# EAGLE board AllOfTheAbove7x14nov_stijnrouting (EAGLE 7.7.0)
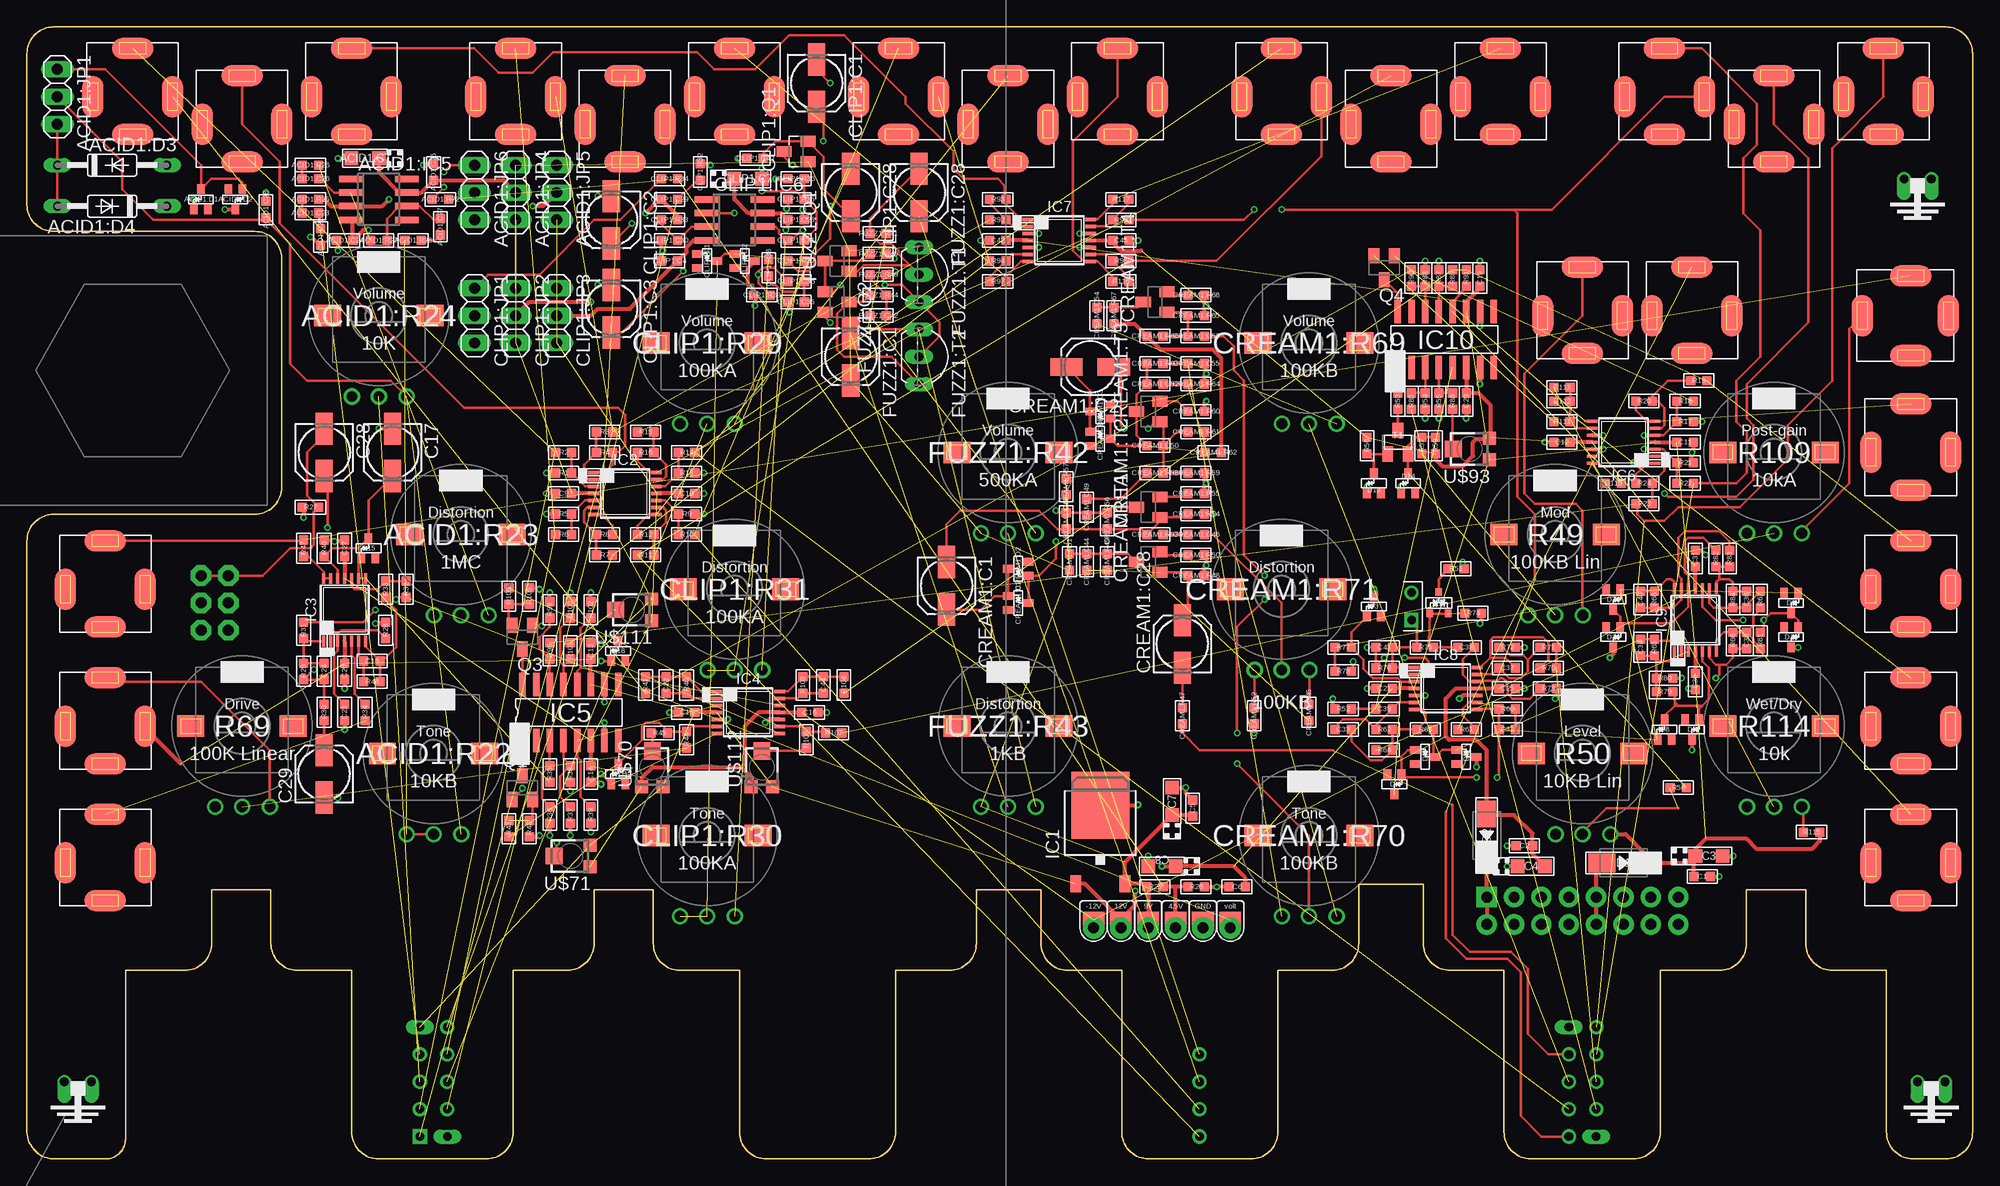
[diagram p10: board, top side]
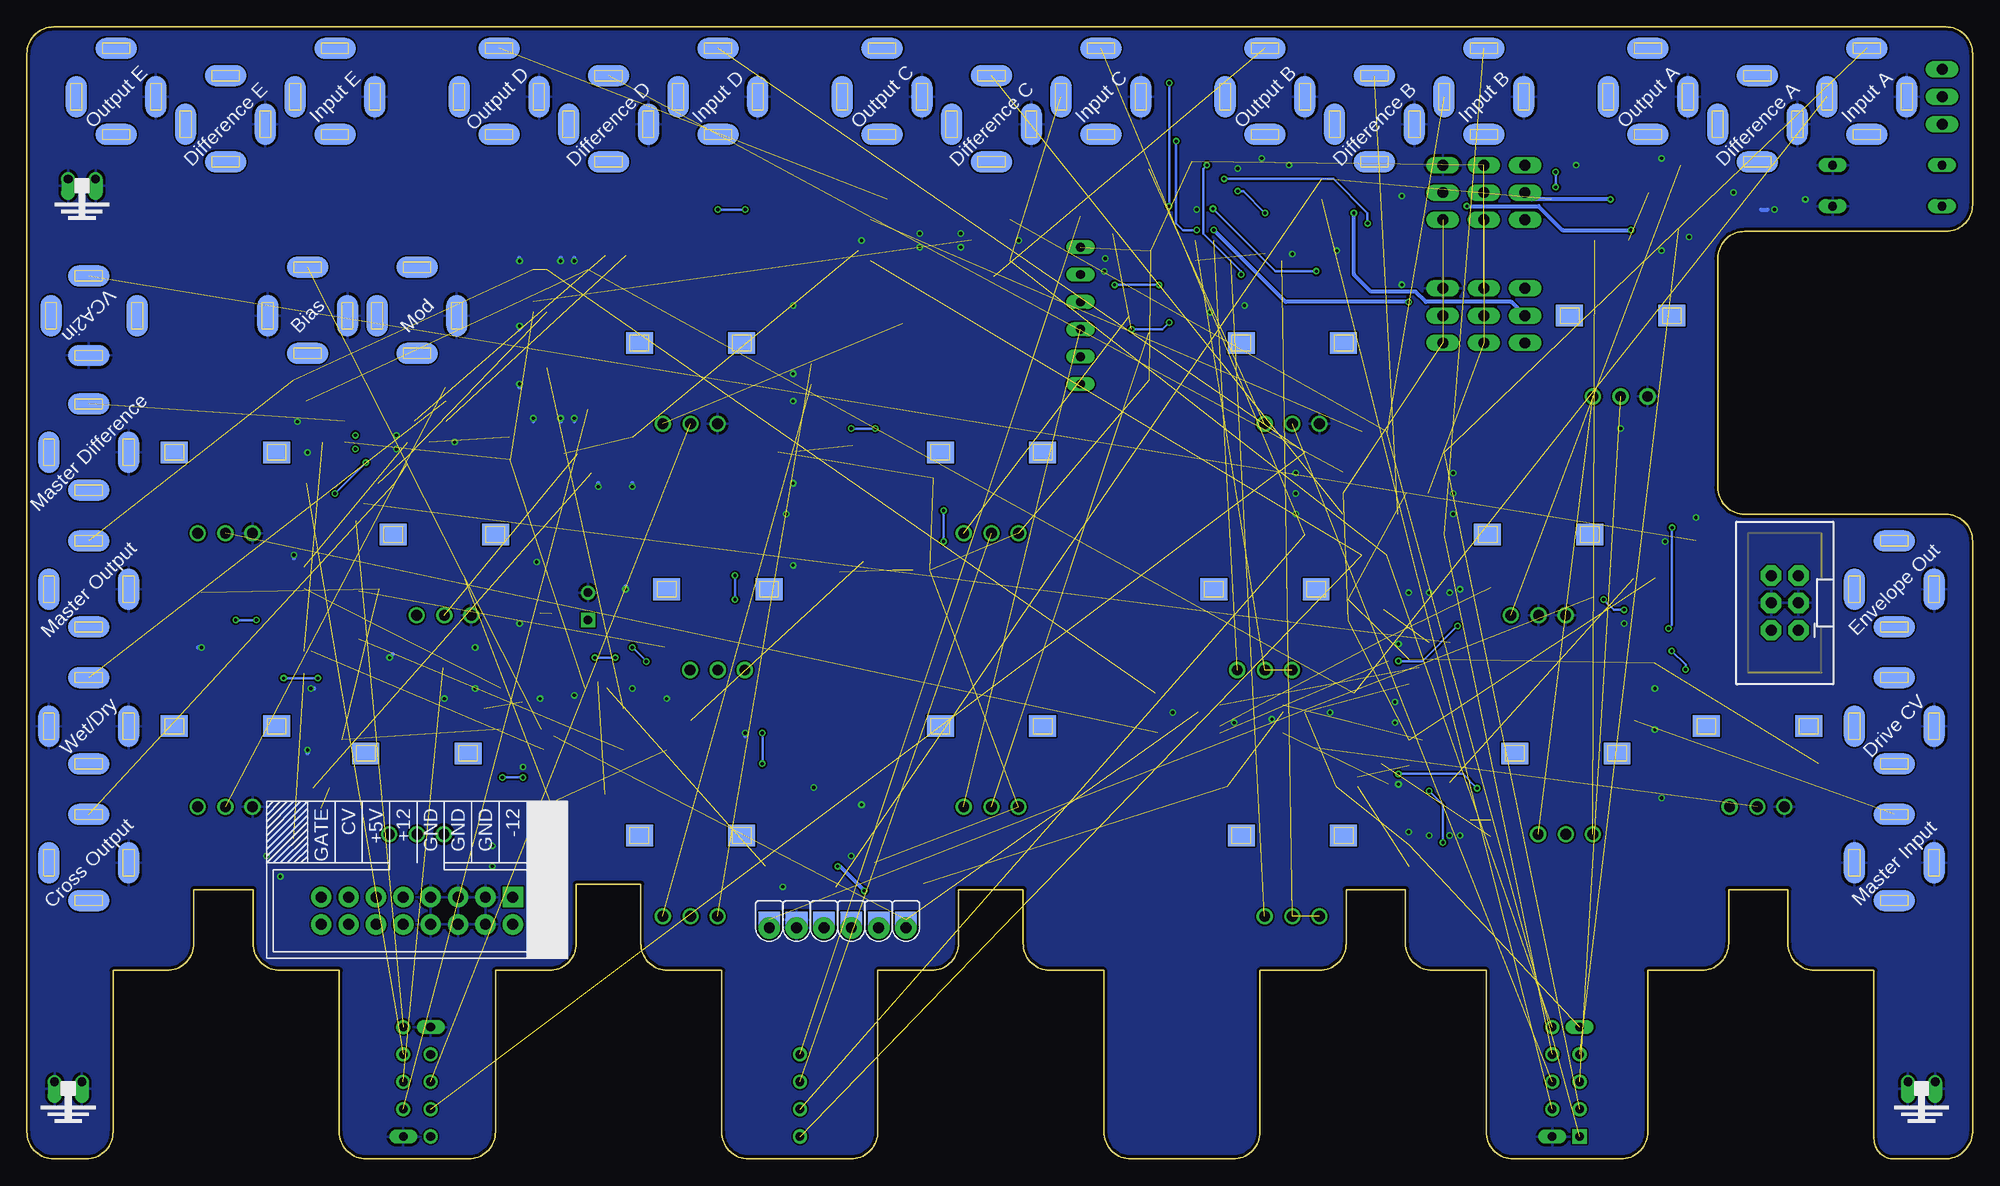
[diagram p11: board, bottom side, seen from below]

Size 180.66 x 105.08 mm. Coordinates in mm from the lower left corner, seen from the top.
Copper layers (1*16): Top 0.035mm / dielectric 1.5mm / Bottom 0.035mm
Design rules "ITeadstudio": minimum track width 6mil, minimum drill 12mil, track to track 6mil, track to pad 6mil, pad to pad 6mil, via to via 6mil, smd to smd 0mil, copper to edge 10mil, drill to drill 10mil, minimum pad ring 10mil, minimum via ring 6mil, stop-mask expansion 2mil, vias tented up to drill 100mil, thermal gap 10mil
Net classes: 0 default: width 0.254 mm; 1 power: width 0.381 mm

## Footprints (pad centres in the part's own frame; a part is rotated, then mirrored left to right if it is on the bottom)
CASE-A_3216 = smd 1.27 x 1.27: + -1.27,0; - 1.27,0
C0603 = smd 0.889 x 0.889: 1 -0.762,0; 2 0.762,0
SOT-323 = smd 0.7 x 0.9: ANODE -0.65,-0.95; CATHODE 0,0.95; NC 0.65,-0.95
DO35-10 = drill 0.813 long: A 5.08,0; C -5.08,0
SO08 = smd 0.6 x 2.2: 1 -1.905,-2.6; 2 -0.635,-2.6; 3 0.635,-2.6; 4 1.905,-2.6; 5 1.905,2.6; 6 0.635,2.6; 7 -0.635,2.6; 8 -1.905,2.6
1X03 = drill 1.016 long: 1 -2.54,0; 2 0,0; 3 2.54,0
ALPS_POT_SQUAREHOLES = drill 1: P$1 -2.5,-7.5; P$2 0,-7.5; P$3 2.58,-7.5 | smd 2.5 x 2: P$4 -4.75,0; P$5 4.75,0 | smd 2.5 x 2 bottom: P$6 -4.75,0; P$7 4.75,0
R0603 = smd 0.889 x 0.889: 1 -0.762,0; 2 0.762,0
153CLV-0505 = smd 3 x 1.6: + 2.2,0; - -2.2,0
SOT23 = smd 1 x 1.4: 1 -0.95,-1.1; 2 0.95,-1.1; 3 0,1.1
SOT23-BEC = smd 1 x 1.4: B -0.95,-1.1; C 0,1.1; E 0.95,-1.1
DO-214AC = smd 2.5 x 1.7: 1 -2,0; 2 2,0
TO92-EBC = drill 0.813 long: B 0,-1.27; C 2.54,-1.27; E -2.54,-1.27
TO252 = smd 1 x 1.6: 1 -2.28,-4.8; 2 2.28,-4.8 | smd 5.4 x 6.2: 3 0,2.5
TSSOP14 = smd 0.305 x 0.991: 1 -1.95,-2.918; 2 -1.3,-2.918; 3 -0.65,-2.918; 4 0,-2.918; 5 0.65,-2.918; 6 1.3,-2.918; 7 1.95,-2.918; 8 1.95,2.918; 9 1.3,2.918; 10 0.65,2.918; 11 0,2.918; 12 -0.65,2.918; 13 -1.3,2.918; 14 -1.95,2.918
SO16 = smd 0.6 x 2.2: 1 -4.445,-2.6; 2 -3.175,-2.6; 3 -1.905,-2.6; 4 -0.635,-2.6; 5 0.635,-2.6; 6 1.905,-2.6; 7 3.175,-2.6; 8 4.445,-2.6; 9 4.445,2.6; 10 3.175,2.6; 11 1.905,2.6; 12 0.635,2.6; 13 -0.635,2.6; 14 -1.905,2.6; 15 -3.175,2.6; 16 -4.445,2.6
3.5MM-JACK-SWITCH-13MM-NOHOLES = smd 1.95 x 3.85 bottom: RING_B@1 -3.7,0; SWITCH_B@1 3.7,0 | smd 1.95 x 3.85: RING_T@3 -3.7,0; SWITCH_T@3 3.7,0 | smd 3.85 x 1.95 bottom: SECOND_B@1 0,-3.5; TIP_B@1 0,4.5 | smd 3.85 x 1.95: SECOND_T@3 0,-3.5; TIP_T@3 0,4.5
POWER_16_SHROUDED = drill 1.016 pad 1.88 square: 1 -8.89,-1.27 | drill 1.016 pad 1.88: 2 -8.89,1.27; 3 -6.35,-1.27; 4 -6.35,1.27; 5 -3.81,-1.27; 6 -3.81,1.27; 7 -1.27,-1.27; 8 -1.27,1.27; 9 1.27,-1.27; 10 1.27,1.27; 11 3.81,-1.27; 12 3.81,1.27; 13 6.35,-1.27; 14 6.35,1.27; 15 8.89,-1.27; 16 8.89,1.27
POWERTESTPAD = drill 1 pad 2: P$1 0,0 | smd 2 x 1.5: P$2 0,-0.75 | smd 2 x 1.5 bottom: P$3 0,-0.75
BYPASSBOARD = drill 0.8 long: 12V 31.75,15.24; GND 34.29,5.08; GND2 138.43,15.24; GND3 140.97,5.08 | drill 0.8 square: P$1 31.75,5.08 | drill 0.8: P$2 31.75,10.16; P$3 31.75,7.62; P$4 31.75,12.7; P$5 34.29,15.24; P$6 34.29,10.16; P$7 34.29,12.7; P$8 34.29,7.62; P$9 104.14,5.08; P$10 104.14,10.16; P$11 104.14,7.62; P$12 104.14,12.7; P$13 138.43,5.08; P$14 138.43,10.16; P$15 138.43,7.62; P$16 138.43,12.7; P$17 140.97,15.24; P$18 140.97,10.16; P$19 140.97,12.7; P$20 140.97,7.62
GROUNDLOOP = drill 0.8 offset: P$1 1.27,0; P$2 -1.27,0
2X3-SHROUDED = drill 1.016 pad 1.88 octagon: 1 -1.27,2.54; 2 1.27,2.54; 3 -1.27,0; 4 1.27,0; 5 -1.27,-2.54; 6 1.27,-2.54
TC33X = smd 1.2 x 1.2: 1 -1,-1.825; 3 1,-1.825 | smd 1.5 x 1.6: 2 0,1.5
SOT23' = smd 0.6 x 0.7: P$1 -0.85,-1; P$2 0.85,-1; P$3 0,1
TESTPAD_DUAL_PTH = drill 0.8 square: P$1 -1.27,0 | drill 0.8: P$2 1.27,0

## Placement (x,y rotation side)
ACID1:C7  10uF  [CASE-A_3216]  31.41,92.89 180 top
ACID1:C22  1nF  [C0603]  27.28,85.58 270 top
ACID1:C23  10nF  [C0603]  26.33,87.81 180 top
ACID1:C24  100n  [C0603]  29.5,85.27 180 top
ACID1:C25  100n  [C0603]  37.76,91.61 90 top
ACID1:C26  47nF  [C0603]  26.33,90.98 0 top
ACID1:C27  1uF  [C0603]  38.39,86.53 270 top
ACID1:C28  1nF  [C0603]  22.2,88.12 270 top
ACID1:D1  BAS16W  [SOT-323]  16.17,89.08 0 top
ACID1:D2  BAS16W  [SOT-323]  19.34,89.08 180 top
ACID1:D3  1N4148DO35-10  [DO35-10]  7.91,92.25 0 top
ACID1:D4  1N4148DO35-10  [DO35-10]  7.91,88.44 180 top
ACID1:IC5  UA741D  [SO08]  32.68,89.08 270 top
ACID1:JP1  GERMANIUMSELECTOR  [1X03]  2.83,98.6 270 top
ACID1:JP4  ACID+  [1X03]  45.38,89.71 270 top
ACID1:JP5  ACID-  [1X03]  49.19,89.71 270 top
ACID1:JP6  ACIDBIAS  [1X03]  41.57,89.71 270 top
ACID1:R22  10KB  [ALPS_POT_SQUAREHOLES]  37.76,37.64 0 top
ACID1:R23  1MC  [ALPS_POT_SQUAREHOLES]  40.3,57.96 0 top
ACID1:R24  10K  [ALPS_POT_SQUAREHOLES]  32.68,78.28 0 top
ACID1:R25  10K  [R0603]  26.33,89.08 180 top
ACID1:R26  4.7K  [R0603]  26.33,92.25 0 top
ACID1:R27  1M  [R0603]  32.68,85.27 0 top
ACID1:R28  5.6K  [R0603]  35.85,85.27 0 top
ACID1:R72  1M  [R0603]  38.39,89.08 0 top
C1  100n  [C0603]  155.55,26.21 180 top
C2  100n  [C0603]  139.04,29.07 180 top
C3  10u  [CASE-A_3216]  156.18,28.11 0 top
C4  10u  [CASE-A_3216]  139.67,27.16 0 top
C5  100n  [C0603]  108.24,32.56 270 top
C6  100n  [C0603]  112.37,25.26 0 top
C7  10u  [CASE-A_3216]  106.34,33.2 90 top
C8  10u  [CASE-A_3216]  105.38,27.16 180 top
C9  100n  [C0603]  49.82,61.77 0 top
C10  100n  [C0603]  61.25,61.77 0 top
C11  100n  [C0603]  153.96,66.53 180 top
C12  100n  [C0603]  142.53,66.53 180 top
C13  100n  [C0603]  52.36,47.16 270 top
C14  100n  [C0603]  52.36,35.73 270 top
C15  100n  [C0603]  61.25,41.45 0 top
C16  100n  [C0603]  72.68,41.45 0 top
C17  10uF  [153CLV-0505]  33.95,65.58 270 top
C18  10pF  [C0603]  32.04,46.21 0 top
C19  100n  [C0603]  134.91,81.77 270 top
C20  100n  [C0603]  133.64,70.34 270 top
C21  100n  [C0603]  126.02,43.67 0 top
C22  10pF  [C0603]  59.35,43.99 90 top
C23  10pF  [C0603]  29.5,41.45 90 top
C24  47pF  [C0603]  27.6,45.26 270 top
C25  100n  [C0603]  137.45,43.67 0 top
C26  100n  [C0603]  29.5,45.26 90 top
C27  100n  [C0603]  29.5,56.69 90 top
C28  10uF  [153CLV-0505]  27.6,65.58 270 top
C29  10uF  [153CLV-0505]  27.6,35.73 90 top
C30  100n  [C0603]  154.91,44.31 90 top
C31  100n  [C0603]  154.91,55.74 90 top
C32  33p  [C0603]  137.45,39.86 0 top
C33  220p  [C0603]  122.21,39.86 180 top
C34  33p  [C0603]  149.83,47.48 90 top
C35  33p  [C0603]  159.68,48.12 270 top
C36  33p  [C0603]  159.68,51.93 270 top
C37  33p  [C0603]  137.45,45.58 180 top
C38  100n  [C0603]  133.64,47.48 180 top
C39  680n  [C0603]  126.02,41.77 0 top
C40  33p FIX  [C0603]  149.83,51.93 270 top
C41  33p FIX  [C0603]  126.02,47.48 180 top
C42  100n  [C0603]  90.14,85.27 0 top
C43  100n  [C0603]  101.57,85.27 0 top
C44  10pF  [C0603]  73.95,43.99 90 top
CLIP1:C1  4.7uF  [153CLV-0505]  73.32,99.87 270 top
CLIP1:C2  2.2uF  [153CLV-0505]  54.27,87.17 270 top
CLIP1:C3  4.7uF  [153CLV-0505]  54.27,78.92 270 top
CLIP1:C4  100n  [C0603]  59.66,83.36 180 top
CLIP1:C7  10uF  [CASE-A_3216]  66.97,90.98 0 top
CLIP1:C25  100n  [C0603]  71.41,87.17 0 top
CLIP1:C28  1uF  [153CLV-0505]  76.49,89.71 270 top
CLIP1:C29  22nF  [C0603]  59.66,89.08 180 top
CLIP1:C30  1nF  [C0603]  59.66,85.27 0 top
CLIP1:C31  100pF  [C0603]  71.41,85.27 180 top
CLIP1:C35  3.3nF  [C0603]  71.41,79.55 180 top
CLIP1:C36  22nF  [C0603]  71.41,81.45 180 top
CLIP1:D1  BAS16W  [SOT-323]  63.16,83.36 270 top
CLIP1:D2  BAS16W  [SOT-323]  66.65,83.36 270 top
CLIP1:IC6  UA741D  [SO08]  65.7,87.17 270 top
CLIP1:JP1  CLIPBIAS  [1X03]  41.57,78.28 270 top
CLIP1:JP2  CLIP+  [1X03]  45.38,78.28 270 top
CLIP1:JP3  CLIP-  [1X03]  49.19,78.28 270 top
CLIP1:Q1  SST201  [SOT23]  71.41,93.52 90 top
CLIP1:R29  100KA  [ALPS_POT_SQUAREHOLES]  63.16,75.74 0 top
CLIP1:R30  100KA  [ALPS_POT_SQUAREHOLES]  63.16,30.02 0 top
CLIP1:R31  100KA  [ALPS_POT_SQUAREHOLES]  65.7,52.88 0 top
CLIP1:R32  1M  [R0603]  62.52,91.61 90 top
CLIP1:R33  1K  [R0603]  59.66,87.17 180 top
CLIP1:R34  1M  [R0603]  59.66,90.98 0 top
CLIP1:R35  560R  [R0603]  71.41,89.08 0 top
CLIP1:R36  47R  [R0603]  71.41,90.98 0 top
CLIP1:R37  1K  [R0603]  71.41,83.36 0 top
CLIP1:R38  1.5K  [R0603]  68.87,82.72 270 top
CLIP1:R39  1M  [R0603]  68.24,80.19 0 top
CLIP1:R40  10K  [R0603]  67.6,92.89 0 top
CREAM1:C1  1uF  [153CLV-0505]  85.38,53.2 270 top
CREAM1:C2  1uF  [153CLV-0505]  98.72,73.52 180 top
CREAM1:C28  1uF  [153CLV-0505]  107.29,47.8 90 top
CREAM1:C44  470pF  [C0603]  98.4,55.42 90 top
CREAM1:C45  1uF  [C0603]  119.04,41.45 90 top
CREAM1:C46  100nF  [C0603]  108.56,57.96 180 top
CREAM1:C47  470pF  [C0603]  96.49,59.23 90 top
CREAM1:C49  100nF  [C0603]  98.4,60.5 90 top
CREAM1:C50  470pF  [C0603]  104.75,66.22 180 top
CREAM1:C52  4nF  [C0603]  104.75,71.93 0 top
CREAM1:C53  100nF  [C0603]  108.56,76.38 180 top
CREAM1:C54  100nF  [C0603]  99.35,78.28 270 top
CREAM1:C55  10nF  [C0603]  108.56,73.83 180 top
CREAM1:D1  BAS16W  [SOT-323]  92.05,51.61 270 top
CREAM1:D2  BAS16W  [SOT-323]  92.05,54.78 90 top
CREAM1:D3  BAS16W  [SOT-323]  99.67,69.39 90 top
CREAM1:D4  BAS16W  [SOT-323]  99.67,66.85 270 top
CREAM1:R47  39K  [R0603]  107.29,41.13 90 top
CREAM1:R48  47K  [R0603]  108.56,54.15 180 top
CREAM1:R49  470K  [R0603]  100.3,55.42 270 top
CREAM1:R50  100R  [R0603]  108.56,56.05 0 top
CREAM1:R51  10K  [R0603]  96.81,55.42 90 top
CREAM1:R52  1K  [R0603]  113.96,41.13 270 top
CREAM1:R53  10K  [R0603]  104.75,57.96 180 top
CREAM1:R54  100K  [R0603]  108.56,59.87 180 top
CREAM1:R55  150R  [R0603]  108.56,61.77 180 top
CREAM1:R56  470K  [R0603]  100.3,59.23 270 top
CREAM1:R57  10K  [R0603]  96.49,62.41 270 top
CREAM1:R58  10K  [R0603]  104.75,63.67 0 top
CREAM1:R59  100K  [R0603]  108.56,63.67 180 top
CREAM1:R60  150R  [R0603]  108.56,69.39 180 top
CREAM1:R61  470K  [R0603]  108.56,67.48 180 top
CREAM1:R62  10K  [R0603]  110.15,65.58 180 top
CREAM1:R63  39K  [R0603]  104.75,73.83 0 top
CREAM1:R64  22K  [R0603]  108.56,71.93 0 top
CREAM1:R65  100K  [R0603]  108.56,78.28 180 top
CREAM1:R66  430K  [R0603]  104.75,76.38 180 top
CREAM1:R67  15K  [R0603]  100.94,78.28 270 top
CREAM1:R68  3.3K  [R0603]  108.56,80.19 180 top
CREAM1:R69  100KB  [ALPS_POT_SQUAREHOLES]  119.04,75.74 0 top
CREAM1:R70  100KB  [ALPS_POT_SQUAREHOLES]  119.04,30.02 0 top
CREAM1:R71  100KB  [ALPS_POT_SQUAREHOLES]  116.5,52.88 0 top
CREAM1:T1  2n3904  [SOT23-BEC]  104.11,55.42 90 top
CREAM1:T2  2n3904  [SOT23-BEC]  104.11,60.5 90 top
CREAM1:T3  2n3904  [SOT23-BEC]  104.11,69.39 90 top
CREAM1:T4  2n3904  [SOT23-BEC]  104.75,79.55 90 top
D1  1n4001  [DO-214AC]  148.25,27.48 0 top
D2  1n4001  [DO-214AC]  135.55,30.02 270 top
D3  BAS16W  [SOT-323]  125.07,51.29 0 top
D4  BAS16W  [SOT-323]  126.97,34.78 180 top
D5  BAS16W  [SOT-323]  133.64,37.32 270 top
D6  BAS16W  [SOT-323]  129.83,37.32 270 top
D7  BAS16W  [SOT-323]  154.6,39.86 180 top
D8  BAS16W  [SOT-323]  152.06,39.86 0 top
D9  BAS16W  [SOT-323]  163.8,51.61 180 top
D10  BAS16W  [SOT-323]  147.29,51.93 180 top
D11  BAS16W  [SOT-323]  147.29,48.44 180 top
D12  BAS16W  [SOT-323]  163.8,48.44 180 top
D13  BAS16W  [SOT-323]  125.07,62.72 0 top
D14  BAS16W  [SOT-323]  128.24,62.72 0 top
D15  BAS16W  [SOT-323]  31.72,56.69 0 top
D17  BAS16W  [SOT-323]  54.9,35.73 0 top
D18  BAS16W  [SOT-323]  54.9,47.16 0 top
FUZZ1:C1  20uF  [153CLV-0505]  76.49,74.47 270 top
FUZZ1:C28  2.2uF  [153CLV-0505]  82.84,89.71 270 top
FUZZ1:C42  10nF  [C0603]  79.03,78.28 180 top
FUZZ1:Q1  MMBT3906LT1SMD  [SOT23-BEC]  75.22,83.36 90 top
FUZZ1:Q2  MMBT3906LT1SMD  [SOT23-BEC]  75.22,79.55 270 top
FUZZ1:R41  100K  [R0603]  79.03,85.9 180 top
FUZZ1:R42  500KA  [ALPS_POT_SQUAREHOLES]  91.1,65.58 0 top
FUZZ1:R43  1KB  [ALPS_POT_SQUAREHOLES]  91.1,40.18 0 top
FUZZ1:R44  8.2K  [R0603]  79.03,80.19 180 top
FUZZ1:R45  33K  [R0603]  79.03,84 180 top
FUZZ1:R46  470R  [R0603]  79.03,82.09 180 top
FUZZ1:T1  [TO92-EBC]  84.11,82.09 270 top
FUZZ1:T2  [TO92-EBC]  84.11,74.47 270 top
IC1  7809DT  [TO252]  99.67,30.34 0 top
IC2  TL074TSSOP14  [TSSOP14]  55.54,61.77 270 top
IC3  TL074TSSOP14  [TSSOP14]  29.5,50.98 0 top
IC4  TL074TSSOP14  [TSSOP14]  66.97,41.45 270 top
IC5  LM13700M  [SO16]  50.46,41.45 0 top
IC6  TL074TSSOP14  [TSSOP14]  148.25,66.53 90 top
IC7  TL074TSSOP14  [TSSOP14]  95.86,85.27 270 top
IC8  TL074TSSOP14  [TSSOP14]  131.74,43.67 270 top
IC9  TL074TSSOP14  [TSSOP14]  154.91,50.02 0 top
IC10  LM13700M  [SO16]  131.74,76.06 0 top
J1  JACK  [3.5MM-JACK-SWITCH-13MM-NOHOLES]  174.92,78.28 90 top
J2  POWERSHROUDED  [POWER_16_SHROUDED]  144.44,23.04 180 bottom
J3  JACK  [3.5MM-JACK-SWITCH-13MM-NOHOLES]  174.92,52.88 0 top
J4  JACK  [3.5MM-JACK-SWITCH-13MM-NOHOLES]  45.38,98.6 0 top
J5  JACK  [3.5MM-JACK-SWITCH-13MM-NOHOLES]  55.54,96.06 0 top
J6  JACK  [3.5MM-JACK-SWITCH-13MM-NOHOLES]  9.82,98.6 0 top
J7  JACK  [3.5MM-JACK-SWITCH-13MM-NOHOLES]  30.14,98.6 0 top
J8  JACK  [3.5MM-JACK-SWITCH-13MM-NOHOLES]  19.98,96.06 0 top
J9  JACK  [3.5MM-JACK-SWITCH-13MM-NOHOLES]  65.7,98.6 0 top
J10  JACK  [3.5MM-JACK-SWITCH-13MM-NOHOLES]  174.92,65.58 0 top
J11  JACK  [3.5MM-JACK-SWITCH-13MM-NOHOLES]  80.94,98.6 0 top
J12  JACK  [3.5MM-JACK-SWITCH-13MM-NOHOLES]  91.1,96.06 0 top
J13  JACK  [3.5MM-JACK-SWITCH-13MM-NOHOLES]  101.26,98.6 0 top
J14  JACK  [3.5MM-JACK-SWITCH-13MM-NOHOLES]  116.5,98.6 0 top
J15  JACK  [3.5MM-JACK-SWITCH-13MM-NOHOLES]  126.66,96.06 0 top
J16  JACK  [3.5MM-JACK-SWITCH-13MM-NOHOLES]  136.82,98.6 0 top
J17  JACK  [3.5MM-JACK-SWITCH-13MM-NOHOLES]  152.06,98.6 0 top
J18  JACK  [3.5MM-JACK-SWITCH-13MM-NOHOLES]  162.22,96.06 0 top
J19  JACK  [3.5MM-JACK-SWITCH-13MM-NOHOLES]  172.38,98.6 0 top
J20  JACK  [3.5MM-JACK-SWITCH-13MM-NOHOLES]  7.28,27.48 0 top
J21  JACK  [3.5MM-JACK-SWITCH-13MM-NOHOLES]  7.28,40.18 0 top
J22  JACK  [3.5MM-JACK-SWITCH-13MM-NOHOLES]  144.44,78.28 0 top
J23  JACK  [3.5MM-JACK-SWITCH-13MM-NOHOLES]  154.6,78.28 0 top
J24  JACK  [3.5MM-JACK-SWITCH-13MM-NOHOLES]  7.28,52.88 0 top
J25  JACK  [3.5MM-JACK-SWITCH-13MM-NOHOLES]  174.92,40.18 0 top
J26  JACK  [3.5MM-JACK-SWITCH-13MM-NOHOLES]  174.92,27.48 0 top
PCB1  EURORACK_PCB5STOMP  [EURORACK36HP_5STOMP]  -0.34,-3 0 top
Q1  MMBT3906LT1SMD  [SOT23-BEC]  46.01,34.47 0 top
Q3  MMBT3906LT1SMD  [SOT23-BEC]  46.01,48.44 180 top
Q4  MMBT3906LT1SMD  [SOT23-BEC]  126.02,82.72 180 top
R1  100k  [R0603]  49.82,63.67 180 top
R2  100k  [R0603]  49.82,65.58 180 top
R3  100k  [R0603]  53.63,67.48 0 top
R4  100k  [R0603]  53.63,65.58 180 top
R5  100k  [R0603]  49.82,59.87 180 top
R6  100k  [R0603]  49.82,57.96 180 top
R7  100k  [R0603]  53.63,56.05 0 top
R8  100k  [R0603]  53.63,57.96 180 top
R9  100k  [R0603]  61.25,59.87 0 top
R10  100k  [R0603]  61.25,57.96 0 top
R11  100k  [R0603]  57.44,56.05 180 top
R12  100k  [R0603]  57.44,57.96 0 top
R13  100k  [R0603]  61.25,63.67 0 top
R14  100k  [R0603]  61.25,65.58 0 top
R15  100k  [R0603]  57.44,67.48 180 top
R16  100k  [R0603]  57.44,65.58 0 top
R17  100k  [R0603]  153.96,68.44 0 top
R18  100k  [R0603]  153.96,70.34 0 top
R19  100k  [R0603]  155.23,72.25 0 top
R20  100k  [R0603]  150.15,70.34 0 top
R21  100k  [R0603]  153.96,64.63 0 top
R22  100k  [R0603]  153.96,62.72 0 top
R23  100k  [R0603]  150.15,60.82 180 top
R24  100k  [R0603]  150.15,62.72 0 top
R25  100k  [R0603]  104.75,25.26 180 top
R26  100k  [R0603]  108.56,25.26 180 top
R27  1M  [R0603]  26.33,60.5 0 top
R28  150K  [R0603]  33.31,49.07 270 top
R29  10K  [R0603]  25.69,45.26 90 top
R30  470R  [R0603]  27.6,41.45 90 top
R31  1K  [R0603]  25.69,49.07 90 top
R32  100K  [R0603]  35.22,52.88 270 top
R33  100K  [R0603]  33.31,52.88 270 top
R34  100k  [R0603]  31.41,41.45 90 top
R35  4.7K  [R0603]  48.55,35.73 90 top
R36  10R  [R0603]  48.55,31.92 90 top
R37  10R  [R0603]  50.46,31.92 270 top
R38  100K  [R0603]  50.46,35.73 270 top
R39  100K  [R0603]  52.36,31.92 270 top
R40  100K  [R0603]  61.25,43.99 90 top
R41  1K  [R0603]  57.44,43.99 270 top
R42  10K  [R0603]  46.65,30.66 90 top
R43  100K  [R0603]  44.74,30.66 90 top
R44  100K  [R0603]  61.25,38.91 90 top
R45  330K  [R0603]  58.71,39.55 0 top
R46  330K  [R0603]  27.6,56.69 270 top
R47  1K  [R0603]  25.69,56.69 270 top
R48  100k  [R0603]  32.04,44.31 0 top
R49  100KB Lin  [ALPS_POT_SQUAREHOLES]  141.9,57.96 0 top
R50  10KB Lin  [ALPS_POT_SQUAREHOLES]  144.44,37.64 0 top
R51  14  [R0603]  132.69,54.78 0 top
R52  470K  [R0603]  122.21,41.77 180 top
R53  4K7  [R0603]  127.29,70.34 90 top
R54  100  [R0603]  129.83,70.34 90 top
R55  100  [R0603]  131.1,70.34 90 top
R56  470K  [R0603]  124.43,66.22 90 top
R57  22K  [R0603]  129.51,66.22 270 top
R58  33K  [R0603]  153.33,34.47 180 top
R59  4M7  [R0603]  130.78,66.22 90 top
R60  10K  [R0603]  137.45,41.77 0 top
R61  47K  [R0603]  133.64,39.86 180 top
R62  33K  [R0603]  126.02,39.86 180 top
R63  33K  [R0603]  129.83,39.86 180 top
R64  100K  [R0603]  126.02,37.96 0 top
R65  100K  [R0603]  151.1,47.48 90 top
R66  100K  [R0603]  158.41,48.12 270 top
R67  100K  [R0603]  160.95,51.93 270 top
R68  100K  [R0603]  151.1,51.93 270 top
R69  100K Linear  [ALPS_POT_SQUAREHOLES]  19.98,40.18 0 top
R70  100  [R0603]  141.26,45.58 180 top
R71  100K  [R0603]  141.26,47.48 180 top
R72  10K  [R0603]  137.45,47.48 0 top
R73  220K  [R0603]  141.26,43.67 180 top
R74  10K  [R0603]  134.28,50.66 180 top
R75  6K8  [R0603]  129.83,47.48 0 top
R76  100K  [R0603]  126.02,45.58 0 top
R77  33K  [R0603]  122.21,47.48 0 top
R78  100K  [R0603]  122.21,45.26 0 top
R79  33K  [R0603]  152.06,43.35 180 top
R80  100K  [R0603]  152.06,44.62 180 top
R81  33K  [R0603]  160.95,48.12 270 top
R82  33K  [R0603]  156.82,55.74 270 top
R83  100K  [R0603]  158.09,55.74 270 top
R84  100K  [R0603]  158.41,51.93 270 top
R85  27k  [R0603]  128.56,70.34 270 top
R86  150k  [R0603]  132.37,70.34 270 top
R87  1k  [R0603]  131.1,81.77 270 top
R88  1k  [R0603]  129.83,81.77 270 top
R89  200k  [R0603]  132.37,81.77 90 top
R90  200k  [R0603]  128.56,81.77 90 top
R91  47k  [R0603]  133.64,81.77 270 top
R92  100k  [R0603]  90.14,87.17 0 top
R93  100k  [R0603]  90.14,89.08 0 top
R94  100k  [R0603]  90.14,83.36 0 top
R95  100k  [R0603]  101.57,83.36 180 top
R96  100k  [R0603]  101.57,87.17 180 top
R97  100k  [R0603]  90.14,81.45 0 top
R98  4.7K  [R0603]  48.55,47.16 270 top
R99  10R  [R0603]  48.55,50.98 270 top
R100  10R  [R0603]  50.46,50.98 90 top
R101  100K  [R0603]  50.46,47.16 90 top
R102  100K  [R0603]  52.36,50.98 90 top
R103  100K  [R0603]  72.05,43.99 90 top
R104  1K  [R0603]  75.86,43.99 270 top
R105  10K  [R0603]  46.65,52.24 270 top
R106  100K  [R0603]  44.74,52.24 270 top
R107  100K  [R0603]  74.9,39.55 180 top
R108  330K  [R0603]  72.36,38.91 90 top
R109  10kA  [ALPS_POT_SQUAREHOLES]  162.22,65.58 0 top
R110  47k  [R0603]  147.29,62.72 0 top
R111  2.2k  [R0603]  142.53,68.44 0 top
R112  18k  [R0603]  142.53,70.34 180 top
R113  18k  [R0603]  142.53,71.61 180 top
R114  10k  [ALPS_POT_SQUAREHOLES]  162.22,40.18 0 top
R115  14k  [R0603]  165.71,30.34 180 top
R116  100k  [R0603]  101.57,81.45 180 top
R117  100k  [R0603]  101.57,89.08 180 top
T1  3906  [SOT23-BEC]  127.29,66.53 0 top
U$13  VOLTAGETESTPAD  [POWERTESTPAD]  101.57,21.45 180 top
U$15  VOLTAGETESTPAD  [POWERTESTPAD]  111.73,21.45 180 top
U$22  5STOMPBOARD  [BYPASSBOARD]  4.74,-3 0 top
U$23  HEADPHONEHOLE_BIGGAP  [HEADPHONEHOLE_GAP]  9.82,73.2 180 top
U$41  VOLTAGETESTPAD  [POWERTESTPAD]  99.03,21.45 180 top
U$42  VOLTAGETESTPAD  [POWERTESTPAD]  104.11,21.45 180 top
U$43  VOLTAGETESTPAD  [POWERTESTPAD]  109.19,21.45 180 top
U$44  VOLTAGETESTPAD  [POWERTESTPAD]  106.65,21.45 180 top
U$48  GNDLOOP  [GROUNDLOOP]  176.82,7.16 0 top
U$49  GNDLOOP  [GROUNDLOOP]  175.55,90.98 0 top
U$50  GNDLOOP  [GROUNDLOOP]  4.74,7.16 0 top
U$68  HEADPHONE  [2X3-SHROUDED]  17.44,51.61 180 bottom
U$70  100k  [TC33X]  58.08,36.37 0 top
U$71  100k  [TC33X]  50.46,28.11 90 top
U$74  BAT54S  [SOT23']  131.1,51.61 0 top
U$92  TESTPOINT_DUAL_PTH  [TESTPAD_DUAL_PTH]  128.56,51.29 90 top
U$93  50K  [TC33X]  133.96,65.9 90 top
U$111  100k  [TC33X]  56.17,50.98 90 top
U$112  100k  [TC33X]  68.24,36.37 0 top

## Tracks (layer width: path | path; a pad name or v marks a point on that pad's centre or on a via)
4.5V  (2 unrouted)
  Top 0.381: R26.2 106.65,25.26 | 106.65,25.26 R25.1 | U$44.P$2 106.65,25.26
9V  (11 unrouted)
  Top 0.381: CREAM1:R67.2 102.84,77.52 CREAM1:R66.2 105.26,75.11 110.15,75.11 110.91,74.34 CREAM1:R62.1 | C5.2 108.11,31.92 C7.+ 101.95,27.54 IC1.2 103.71,25.54 R25.2 104.11,25.13 U$42.P$2
12V  (via drill 0.3)  (19 unrouted)
  Top 0.381: IC4.4 C15.2 | IC7.4 C42.2 | IC8.4 C21.2 | C6.2 113.13,26.08 112.05,27.16 C8.+ v105.38,27.16 | IC5.11 C13.2 | IC2.4 C9.2 | C1.2 154.79,27.48 | 154.79,27.48 154.79,27.99 C3.+ 154.91,28.75 155.87,29.7 159.68,29.7 160.63,28.75 165.71,28.75 166.47,29.51 R115.1 | IC1.1 98.23,25.54 U$13.P$2 102.91,23.53 v102.91,24.89 | IC3.4 C26.2 | IC6.4 C11.2 | IC9.4 C30.2 | 154.79,27.48 D1.2 150.25,28.34 148.44,30.14 R50.P$3 | IC10.11 133.64,79.55 134.91,80.82 C19.2 | J21.SWITCH_T@3 10.98,39.97 14.26,36.69
  Bottom 0.381: v102.91,24.89 105.18,27.16 v105.38,27.16
-12V  (14 unrouted)
  Top 0.381: C16.1 IC4.11 67.92,41.45 66.65,40.18 66.65,36.69 66.33,36.37 | IC7.11 C43.1 100.81,85.08 101.57,84.31 103.48,84.31 | C25.1 IC8.11 132.69,43.67 131.74,42.72 131.74,39.23 132.05,38.91 134.59,38.91 135.55,37.96 D2.1 | U$70.1 57.12,34.59 57.12,35.42 58.08,36.37 66.33,36.37 | 66.33,36.37 67.28,35.42 67.28,34.59 U$112.1 | IC5.6 C14.1 | C4.- 139.8,28.3 C2.1 139.8,30.21 138.09,31.92 135.64,31.92 D2.1 | C27.1 IC3.11 | C10.1 IC2.11 | IC6.11 C12.1 | IC9.11 C31.1 | 135.96,31.92 D2.1 | IC10.6 C20.1 134.78,71.11 135.86,70.03 135.86,66.98 U$93.3 135.74,66.85 134.59,66.85 134.28,66.53 134.28,65.26 133.32,64.31 131.42,64.31 130.78,64.94 R59.1
ACID1:ACIDNE  (via drill 0.3)
  Top 0.381: ACID1:JP5.2 47.92,88.44 v46.96,88.44 | v31.72,86.22 31.21,86.22 ACID1:C24.1 30.26,86.98 ACID1:IC5.4
  Bottom 0.381: v46.96,88.44 40.3,88.44 38.07,86.22 v31.72,86.22
ACID1:ACIDPL
  Top 0.381: ACID1:C7.+ 32.68,91.61 34.58,89.71 ACID1:IC5.7 36.61,89.71 ACID1:C25.1 44.23,90.85 ACID1:JP4.2
ACID1:ACIDVI  (via drill 0.3)
  Top 0.381: v33.63,89.08 32.99,88.44 ACID1:IC5.3 28.23,88.44 27.6,89.08 ACID1:R25.1
  Bottom 0.381: v33.63,89.08 40.93,89.08 ACID1:JP6.2
ACID1:N$2
  Top 0.254: ACID1:D4.A ACID1:D3.C ACID1:JP1.3
ACID1:N$3
  Top 0.254: ACID1:JP1.1 7.28,101.14 16.17,92.25 ACID1:D1.CATHODE 17.12,90.98 19.66,90.98 19.99,90.65 ACID1:D2.ANODE
ACID1:N$20
  Top 0.254: ACID1:R25.2 ACID1:C23.2
ACID1:N$22  (1 unrouted)
  Top 0.254: ACID1:C26.2 27.28,90.98 28.55,89.71 ACID1:IC5.2
ACID1:N$23
  Top 0.254: ACID1:C26.1 ACID1:R26.1
ACID1:N$32
  Top 0.254: ACID1:C27.1 38.26,87.17 37.76,87.17 36.49,88.44 ACID1:IC5.6 34.58,88.44 33.44,87.3 ACID1:R27.2
ACID1:N$33  (1 unrouted)
ACID1:N$34  (1 unrouted)
  Top 0.254: ACID1:JP1.2 8.86,92.57 8.86,90.03 11.72,87.17 22.01,87.17 ACID1:C28.2 22.01,87.36 24.42,84.95 24.42,73.83 26.01,72.25 33.79,72.25 ACID1:R24.P$3
ACID1:N$35
  Top 0.254: ACID1:C27.2 37.88,85.27 ACID1:R28.2
ACID1:N$36  (1 unrouted)
  Top 0.254: ACID1:R22.P$2 ACID1:R22.P$1
ACID1:TO4.5V  (via drill 0.3)
  Top 0.254: ACID1:R72.1 38.71,90.15 v38.71,90.2 | v38.71,91.61 39.34,92.25 ACID1:JP6.1
  Bottom 0.254: v38.71,90.2 v38.71,91.61
BIASINPUT  (1 unrouted)
BIASMAINLINE  (via drill 0.3)  (3 unrouted)
  Top 0.254: IC8.8 134.7,41.77 R60.1 C32.1 136.69,35.61 v136.5,35.42 | D6.ANODE 128.87,37.96 128.24,37.96 127.62,37.34 D4.ANODE 127.94,35.42 v134.59,35.42
  Bottom 0.254: v136.5,35.42 v134.59,35.42
CLIP1:CLIPNE
  Top 0.381: CLIP1:IC6.4 61.89,85.27 61.25,84.63 61.25,84.19 CLIP1:C4.1 55.98,78.92 53,78.92 52.36,78.28 CLIP1:JP3.2
CLIP1:CLIPPL  (via drill 0.3)
  Top 0.381: CLIP1:C7.+ 65.7,89.08 66.97,87.81 CLIP1:IC6.7 70.01,87.81 CLIP1:C25.1 70.65,86.41 v70.46,86.22 | CLIP1:JP2.2 46.65,79.55 v52.36,79.55
  Bottom 0.381: v52.36,79.55 63.79,79.55 67.44,83.2 v70.46,86.22
CLIP1:CLIPVI  (via drill 0.3)
  Top 0.381: v57.44,87.81 58.71,89.08 CLIP1:C29.2 60.43,87.55 CLIP1:R33.1
  Bottom 0.381: CLIP1:JP1.2 42.84,79.55 50.77,79.55 51.73,80.5 55.85,80.5 57.44,82.09 v57.44,87.81
CLIP1:N$38
  Top 0.254: CLIP1:IC6.3 61.69,86.53 CLIP1:C30.2 58.9,86.79 CLIP1:R33.2
CLIP1:N$41
  Top 0.254: CLIP1:R34.1 55.09,87.17 52.68,87.17 47.6,82.09 42.84,82.09 CLIP1:JP1.1
CLIP1:N$42  (via drill 0.3)  (2 unrouted)
  Top 0.254: CLIP1:C31.1 73.32,86.41 73.32,87.93 CLIP1:R35.2 | CLIP1:R35.2 CLIP1:R36.2 | CLIP1:IC6.2 v65.7,87.81 | v68.24,89.83 71.42,89.83 CLIP1:R35.2
  Bottom 0.254: v65.7,87.81 67.72,89.83 v68.24,89.83
CLIP1:N$43  (via drill 0.3)  (1 unrouted)
  Top 0.254: CLIP1:IC6.6 69.51,86.53 69.82,86.22 69.82,85.9 70.46,85.27 CLIP1:C31.2 70.95,85.27 71.68,85.99 71.82,85.99 v72.05,86.22 | CLIP1:C1.+ 73.95,97.03 v73.95,94.47
  Bottom 0.254: v73.95,94.47 73.95,86.85 73.32,86.22 v72.05,86.22
CLIP1:N$44  (via drill 0.3)
  Top 0.254: CLIP1:R37.1 71.6,82.41 72.51,82.41 73.14,83.04 73.14,83.98 74.59,85.42 v74.59,88.44 | v74.59,99.87 73.32,101.14 CLIP1:C1.-
  Bottom 0.254: v74.59,88.44 v74.59,99.87
CLIP1:N$45  (3 unrouted)
  Top 0.254: CLIP1:D1.CATHODE 64.76,84.01 CLIP1:D2.ANODE
CLIP1:N$46  (1 unrouted)
CLIP1:N$47  (via drill 0.3)
  Top 0.254: CLIP1:R36.1 v69.51,90.98 | v56.17,86.85 54.29,84.97 CLIP1:C2.+
  Bottom 0.254: v69.51,90.98 68.24,90.98 59.35,90.98 56.17,87.81 v56.17,86.85
CLIP1:N$48  (via drill 0.3)
  Top 0.254: CLIP1:C3.+ 55.24,76.72 v60.93,82.41 | v70.53,88.2 70.65,88.31 CLIP1:R35.1
  Bottom 0.254: v60.93,82.41 64.74,82.41 v70.53,88.2
CLIP1:N$49
  Top 0.254: CLIP1:C35.1 CLIP1:C36.1 71.22,80.5 70.14,80.5 69.51,81.14 69.19,81.14 68.87,81.45 CLIP1:R38.2
CLIP1:N$50  (via drill 0.3)
  Top 0.254: CLIP1:R39.2 67.92,81.26 v67.92,82.09 67.92,82.41 68.24,82.72 69.38,82.72 CLIP1:C36.2 | v71.09,92.25 70.31,93.03 CLIP1:Q1.3
  Bottom 0.254: v67.92,82.09 67.92,82.41 71.41,85.9 71.41,91.93 v71.09,92.25
CLIP1:N$51
  Top 0.254: CLIP1:R40.2 68.36,93.33 69.51,94.47 70.46,94.47 CLIP1:Q1.2 73.95,93.03 73.95,90.05 CLIP1:C28.+
CLIP1:N$52  (1 unrouted)
CREAM1:N$1
  Top 0.254: CREAM1:R47.2 CREAM1:C28.-
CREAM1:N$61  (2 unrouted)
  Top 0.254: CREAM1:C28.+ 107.8,50.51 CREAM1:R48.2 107.48,54.47 CREAM1:T1.B
CREAM1:N$62
  Top 0.254: CREAM1:R50.1 105.53,56.05 CREAM1:T1.E
CREAM1:N$63  (1 unrouted)
  Top 0.254: CREAM1:T1.C 102.25,56.18 CREAM1:R49.1 CREAM1:C44.2 CREAM1:R51.2
CREAM1:N$64
  Top 0.254: CREAM1:R71.P$3 119.08,42.25 CREAM1:C45.2
CREAM1:N$65
  Top 0.254: CREAM1:R54.2 107.48,59.55 CREAM1:T2.B 105.21,59.19 CREAM1:R53.2 103.48,58.47 CREAM1:R56.2 CREAM1:C47.1 95.67,58.47 93.95,60.18 86.65,60.18 85.38,58.91 CREAM1:C1.-
CREAM1:N$66
  Top 0.254: CREAM1:D2.CATHODE CREAM1:D1.ANODE 91.08,52.24 89.83,52.24 88.58,51 CREAM1:C1.+
CREAM1:N$67
  Top 0.254: CREAM1:R55.2 107.48,61.45 CREAM1:T2.E
CREAM1:N$68  (via drill 0.3)
  Top 0.254: CREAM1:C47.2 96.62,60.12 CREAM1:R57.2 | CREAM1:C47.2 98.14,59.99 CREAM1:C49.1 98.65,59.99 CREAM1:R56.1 100.81,60.5 CREAM1:T2.C | CREAM1:D1.CATHODE CREAM1:D2.ANODE 93.01,54.15 93.95,54.15 95.54,55.74 v95.54,57.33 | CREAM1:C47.2 95.73,59.99 v95.54,60.18
  Bottom 0.254: v95.54,60.18 v95.54,57.33
CREAM1:N$69
  Top 0.254: CREAM1:C49.2 101.57,61.26 CREAM1:R58.1
CREAM1:N$70  (via drill 0.3)
  Top 0.254: CREAM1:C50.1 105.51,68.14 CREAM1:T3.B 104.75,68.44 v104.11,67.8 | CREAM1:C50.1 CREAM1:R58.2 CREAM1:R59.2 | CREAM1:C50.1 106.78,67.48 CREAM1:R61.2 | v101.89,67.8 101.57,68.12 101.57,72.86 CREAM1:C2.-
  Bottom 0.254: v104.11,67.8 v101.89,67.8
CREAM1:N$71
  Top 0.254: CREAM1:R60.2 106.85,70.34 CREAM1:T3.E
CREAM1:N$72  (1 unrouted)
  Top 0.254: CREAM1:R63.1 CREAM1:C52.1 103.01,70.96 CREAM1:T3.C 103.01,67.19 CREAM1:C50.2 101.25,66.22 CREAM1:D4.CATHODE CREAM1:D3.ANODE | CREAM1:R61.1 109.32,65.64 CREAM1:R62.2
CREAM1:N$73  (via drill 0.3)
  Top 0.254: CREAM1:C53.1 111.1,76.38 112.05,75.42 112.05,73.2 113,72.25 113,56.05 v114.91,54.15 | CREAM1:R70.P$2 119.04,30.02 v112.37,36.69 | v112.37,39.55 112.37,49.39 v114.91,51.93
  Bottom 0.254: v112.37,36.69 v112.37,39.55 | v114.91,51.93 v114.91,54.15
CREAM1:N$74  (1 unrouted)
  Top 0.254: CREAM1:C55.2 CREAM1:R63.2
CREAM1:N$75  (1 unrouted)
  Top 0.254: CREAM1:R64.1 CREAM1:C52.2
CREAM1:N$76
  Top 0.254: CREAM1:D4.ANODE CREAM1:D3.CATHODE 98.72,71.31 CREAM1:C2.+
CREAM1:N$77
  Top 0.254: CREAM1:T4.B 107.48,78.6 CREAM1:R65.2 CREAM1:C53.2 CREAM1:R66.1
CREAM1:N$78
  Top 0.254: CREAM1:T4.C 103.14,79.04 CREAM1:R67.1 CREAM1:C54.1
CREAM1:N$79
  Top 0.254: CREAM1:R68.2 106.16,80.19 CREAM1:T4.E
CREAM1:N$80  (1 unrouted)
CREAM1:N$84
  Top 0.254: CREAM1:R71.P$1 113.96,44.07 CREAM1:R52.1
CREAM1:N$85
  Top 0.254: CREAM1:C46.2 CREAM1:R53.1
CREAM1:N$86
  Top 0.254: CREAM1:C46.1 110.15,57.96 116.5,51.61 CREAM1:R71.P$2
CROSSFADER_OUT  (2 unrouted)
CV_IN  (1 unrouted)
ENVELOPE_OUT  (1 unrouted)
  Top 0.254: J24.TIP_B@1 25.62,57.38 R47.1
EURORACK_IN  (1 unrouted)
FUZZ1:N$53  (via drill 0.3)  (2 unrouted)
  Top 0.254: FUZZ1:T2.E v78.08,77.01 | v74.59,77.64 74.12,78.11 FUZZ1:Q2.E
  Bottom 0.254: v78.08,77.01 75.22,77.01 v74.59,77.64
FUZZ1:N$54
  Top 0.254: FUZZ1:Q1.B 77.13,82.41 77.67,82.95 81.98,82.95 | FUZZ1:T1.B 81.98,82.95 | 81.98,82.95 80.94,84 80.94,84.31 80.3,84.95 79.22,84.95 FUZZ1:R41.2 78.27,87.34 FUZZ1:C28.-
FUZZ1:N$55  (via drill 0.3)
  Top 0.254: FUZZ1:R45.2 77.63,83.36 FUZZ1:Q1.C FUZZ1:Q2.B 74.9,80.5 v75.54,81.14 | v79.67,81.14 81.25,81.14 FUZZ1:T1.C 84.75,77.64 84.75,76.38 FUZZ1:T2.B
  Bottom 0.254: v79.67,81.14 v75.54,81.14
FUZZ1:N$56  (1 unrouted)
FUZZ1:N$57  (1 unrouted)
FUZZ1:N$58
  Top 0.254: FUZZ1:C42.1 FUZZ1:R44.1 78.27,81.71 FUZZ1:R46.2
FUZZ1:N$59
  Top 0.254: FUZZ1:R44.2 77.63,79.55 FUZZ1:Q2.C 75.22,78.45 75.22,75.11 75.86,74.47 80.3,74.47 FUZZ1:T2.C
GND  (via drill 0.3)
  Top 0.381: ACID1:C7.- v28.87,92.89 | ACID1:C28.1 22.01,89.2 v22.2,89.71 | ACID1:D2.CATHODE v18.39,88.12 | ACID1:D1.ANODE 15.52,89.06 v15.53,89.08 | C17.- 32.7,67.78 v32.68,67.8 | ACID1:C22.2 v26.33,85.58 | ACID1:C24.2 28.87,85.14 v28.87,84.31 | ACID1:C25.2 37.63,92.25 v36.8,92.25 | CLIP1:D1.ANODE 63.14,84.01 v63.16,84 | CLIP1:C2.- 53.02,89.37 v53,89.39 | CLIP1:C3.- 53.03,81.11 v53,81.15 | CLIP1:C30.1 58.9,84.44 v59.03,84.31 58.9,84.19 CLIP1:C4.2 | CLIP1:R32.2 63.35,92.38 v63.47,92.25 | CLIP1:R40.1 v66.01,92.89 | CLIP1:C7.- v68.24,91.93 | CLIP1:C25.2 72.05,87.3 v72.05,88.12 | FUZZ1:R45.1 80.11,84 v80.52,83.58 | FUZZ1:R46.1 80.07,82.37 v80.62,82.37 | v67.6,79.23 67.6,80.06 CLIP1:R39.1 67.47,80.63 66.97,81.14 66.97,82.73 CLIP1:D2.CATHODE | CLIP1:C35.2 70.78,79.42 v70.78,78.6 | CREAM1:R68.1 109.32,79.42 v109.51,79.23 109.32,79.04 CREAM1:R65.1 | CREAM1:C55.1 109.51,73.64 v109.51,72.88 109.32,72.69 CREAM1:R64.2 | CREAM1:R60.1 109.32,70.15 v109.51,70.34 | CREAM1:R59.1 109.32,62.91 v109.51,62.72 109.32,62.53 CREAM1:R55.1 | CREAM1:R54.1 v110.15,59.87 | CREAM1:R50.2 109.51,55.86 v109.51,55.1 109.32,54.91 CREAM1:R48.1 | C42.1 v88.56,85.27 | IC7.3 93.94,85.92 v93.95,85.9 | IC7.5 93.94,84.61 v93.95,84.63 | IC7.12 98.76,85.9 v97.76,85.9 | IC7.10 97.78,84.61 v97.76,84.63 | C43.2 v103.16,85.27 | C12.2 v140.94,66.53 | IC6.12 145.34,65.9 v146.34,65.9 | IC6.10 146.33,67.18 v146.34,67.17 | R21.2 154.6,64.75 v154.6,65.58 154.72,65.71 C11.1 | R17.2 v155.55,68.44 | R13.2 v62.84,63.67 | C10.2 v62.84,61.77 | R9.2 v62.84,59.87 | R1.2 v48.23,63.67 | C9.1 v48.23,61.77 | R5.2 v48.23,59.87 | R99.1 v48.55,52.56 | R100.2 v50.46,52.56 | R102.2 v52.36,52.56
  Top 0.381: R105.1 47.47,53.01 v47.6,52.88 | R27.1 25.69,60.37 v25.69,59.55 | IC1.3 103.12,32.84 v103.16,32.88 | C8.- v104.11,28.11 | C7.- v107.61,34.47 107.61,33.96 C5.1 | R51.2 133.32,55.1 v133.32,55.42 | R74.1 135.04,49.83 v134.91,49.7 | R73.1 142.02,42.85 v141.9,42.72 | C29.- 27.62,33.51 v28.87,33.51 | R36.1 v48.55,30.02 | R37.2 v50.46,30.02 | R39.2 v52.36,30.34 | R42.1 47.47,29.89 v47.6,30.02 | C6.1 v110.46,25.26 R26.1 | C13.1 53.19,47.93 v53.31,47.8 | IC5.10 v53.63,42.4 | IC5.7 v53.63,40.5 | C14.2 53.12,34.97 v53.31,34.78 | C4.+ v137.45,27.16 | C2.2 v137.45,29.07 | C3.- v158.41,28.11 | C1.1 v157.14,26.21 | C15.1 v59.66,41.45 | IC4.5 65.05,40.8 v65.06,40.81 | IC4.10 68.89,40.8 v68.55,40.5 | C16.2 v74.27,41.45 | IC8.5 128.83,43.04 v129.83,43.04 | IC8.10 133.34,43.02 v133.01,42.72 | C21.1 v124.43,43.67 | R52.2 121.26,41.96 v121.26,42.72 | C25.2 v139.04,43.67 | R72.2 v139.04,47.48 | 113.76,40.18 CREAM1:R52.2 v113.96,39.55 | D5.CATHODE v134.59,36.37 | R28.1 33.18,49.7 v32.36,49.7 | C26.1 v29.5,43.67 | C23.1 v29.5,39.86 | R46.1 28.42,57.45 v28.55,57.33 29.37,57.33 C27.2 | C31.2 155.42,56.5 v155.87,56.05 | C30.1 154.41,43.55 v154.28,43.67 | D7.CATHODE v154.6,37.96 | D12.CATHODE v164.44,47.48 | D11.CATHODE 147.29,46.85 v146.98,46.53 | C19.1 v134.91,83.36 | IC10.10 v134.91,77.33 | R88.1 v129.83,83.36 | R87.1 v131.1,83.36 | R55.1 v131.1,68.75 | R54.1 v129.83,68.75 | C20.2 v133.64,68.75 | IC10.7 v134.91,71.93 | D14.ANODE 127.59,62.39 v127.61,62.41 | D13.ANODE 124.42,62.39 v124.43,62.41 | D3.CATHODE v125.07,52.88
  Bottom 0.381: 19.66,88.12 19.02,88.12 | v53,81.15 53,81.14 | v80.52,83.58 80.62,83.68 | v80.62,82.37 80.62,82.41 | v155.87,56.05 155.87,55.74 | v154.28,43.67 153.96,43.67 | v154.6,37.96 154.6,37.64 | v164.44,47.48 164.76,47.48 | v146.98,46.53 146.66,46.85 | v134.91,83.36 134.91,83.68 | v134.91,77.33 134.91,77.01 | v129.83,83.36 129.83,83.68 | v131.1,83.36 131.1,83.68 | v131.1,68.75 131.1,68.44 | v129.83,68.75 129.83,68.44 | v133.64,68.75 133.64,68.44 | v134.91,71.93 134.91,71.61 | v127.61,62.41 127.61,62.72 | v124.43,62.41 124.43,62.72 | v113.96,39.55 113.96,39.23 | v125.07,52.88 125.07,53.2
  pour Bottom: -0.34,106.22 -0.34,0.81 -0.98,0.17 181.27,0.17 181.58,0.49 181.58,106.54 181.27,106.86 0.29,106.86
GUITAR_IN
  Top 0.254: C28.- 27.6,67.17 26.01,65.58 26.01,61.58 R27.2 26.64,60.06 26.64,57.01 26.33,56.69 24.42,56.69 21.88,54.15 U$68.6 U$68.5
GUITAR_OUT  (via drill 0.3)  (1 unrouted)
  Top 0.254: R31.2 31.21,49.83 v32.36,50.98 | v34.26,51.93 34.45,52.12 R32.2
  Bottom 0.254: v32.36,50.98 33.31,50.98 v34.26,51.93
INPUT_A  (2 unrouted)
INPUT_B  (2 unrouted)
INPUT_C  (2 unrouted)
INPUT_D  (2 unrouted)
INPUT_E  (1 unrouted)
  Top 0.254: J17.TIP_B@1 155.49,103.1 160.63,97.97 160.63,94.16 159.36,92.89 159.36,87.81 160.95,86.22 160.95,74.47 158.72,72.25 158.72,68.44 159.68,67.48 159.68,63.67 158.72,62.72 R22.2
INPUT_WS  (1 unrouted)
MIX_OUT  (1 unrouted)
  Top 0.254: D15.ANODE 30.8,55.47 IC3.9 IC3.8
N$1
  Top 0.254: R93.1 89.38,88.69 R92.2 91.51,86.56 IC7.2
N$2
  Top 0.381: J2.10 J2.9 145.71,26.94 D1.1
N$3
  Top 0.381: J2.2 J2.1 D2.2
N$4  (1 unrouted)
  Top 0.254: ACID1:C22.1 ACID1:C23.1
N$5  (1 unrouted)
N$6
  Top 0.254: IC7.1 92.32,87.22 90.9,88.63 R93.2 90.78,89.2 90.78,90.34 90.14,90.98 86.97,90.98 86.02,91.93 86.02,93.52 81.57,97.97 81.57,98.6 75.86,104.31 70.78,104.31 67.6,101.14 63.79,101.14 62.2,102.73 48.87,102.73 46.96,100.82 43.79,100.82 41.51,103.1 J7.TIP_B@1
N$7  (1 unrouted)
  Top 0.254: CLIP1:C29.1 62.2,90.85 CLIP1:R32.1
N$8  (1 unrouted)
N$9  (1 unrouted)
N$10  (1 unrouted)
  Top 0.254: U$22.P$16 141.26,9.7 139.36,11.61 139.36,17.64 137.77,19.23 133.96,19.23 132.37,20.81 132.37,32.88 | CREAM1:R47.1 107.29,39.55 108.88,37.96 121.26,37.96
N$11  (1 unrouted)
N$12  (1 unrouted)
N$13
  Top 0.254: IC7.6 91.51,83.97 R94.2 89.38,81.84 R97.1
N$14  (via drill 0.3)
  Top 0.254: C23.2 28.55,43.16 28.55,46.85 28.85,47.15 IC3.3 28.85,48.44 28.85,48.63 | 28.85,48.63 28.85,48.74 29.18,49.07 32.55,49.07 R28.2 | C28.+ 27.91,63.06 v27.91,58.59 | v28.23,49.25 28.85,48.63
  Bottom 0.254: v27.91,58.59 27.91,49.56 v28.23,49.25
N$15
  Top 0.254: IC2.3 51.84,62.42 R1.1 R2.1
N$16
  Top 0.254: IC6.9 143.9,67.83 R111.2 R112.1 R113.1
N$17
  Top 0.254: C24.1 R29.2 R31.1 25.94,48.06 IC3.1
N$18
  Top 0.254: IC2.1 53.68,63.72 54.39,64.44 R4.1 54.9,65.58 55.54,66.22 55.54,69.07 54.9,69.71 40.61,69.71 23.47,86.85 23.47,92.57 19.98,96.06 J8.TIP_B@1
N$19
  Top 0.254: R6.1 R5.1 51.84,61.12 IC2.5
N$20
  Top 0.254: R7.1 R8.2 51.73,59.1 51.73,60.18 52.01,60.47 IC2.6
N$21  (1 unrouted)
N$22  (1 unrouted)
  Top 0.254: IC6.8 144.71,68.48
N$23  (1 unrouted)
  Top 0.254: IC2.7 53.36,59.82 54.39,58.78 R8.1
N$24
  Top 0.254: IC2.10 59.23,61.12 R9.1 R10.1
N$25
  Top 0.254: R11.1 R12.2 59.35,59.1 59.35,60.18 59.06,60.47 IC2.9
N$26
  Top 0.254: R115.2 164.95,32.53 R114.P$3
N$27  (1 unrouted)
N$28  (1 unrouted)
  Top 0.254: IC2.8 57.71,59.82 56.68,58.78 R12.1
N$29
  Top 0.254: R14.1 R13.1 59.23,62.42 IC2.12
N$30
  Top 0.254: R15.1 R16.2 59.35,64.44 59.35,63.36 59.06,63.07 IC2.13
N$31  (1 unrouted)
  Top 0.254: IC7.7 92.32,83.31 90.9,81.9 R97.2
N$32
  Top 0.254: IC7.9 100.21,83.97 R95.2 102.34,81.84 R116.1
N$33  (1 unrouted)
  Top 0.254: IC2.14 57.71,63.72 56.68,64.75 R16.1
N$34  (via drill 0.3)
  Top 0.254: v150.15,67.17 151.15,67.17 IC6.5 151.94,67.18 R17.1 R18.1
N$35
  Top 0.254: IC6.6 151.77,67.83 152.06,68.12 152.06,69.71 151.42,70.34 R20.2 150.91,70.79 152.37,72.25 R19.1
N$36
  Top 0.254: R116.2 100.81,81.9 99.4,83.31 IC7.8 98.13,83.31 97.13,84.31 97.13,94.47 101.26,98.6 J13.TIP_B@1
N$37
  Top 0.254: IC7.13 100.21,86.56 R96.2 102.34,88.69 R117.1
N$38  (1 unrouted)
  Top 0.254: IC6.7 150.42,68.48 149.39,69.52 R20.1
N$39  (via drill 0.3)
  Top 0.254: v150.15,65.9 150.17,65.88 IC6.3 151.94,65.88 R21.1 R22.1
N$40
  Top 0.254: R23.1 R24.2 152.06,63.86 152.06,64.94 151.77,65.23 IC6.2
N$42  (1 unrouted)
  Top 0.254: IC7.14 99.4,87.22 100.81,88.63 R117.2
N$43  (via drill 0.3)
  Top 0.254: IC6.1 150.42,64.58 149.83,63.99 | R24.1 149.39,63.55 149.83,63.99 | J18.TIP_B@1 162.22,96.06 165.39,92.89 165.39,77.64 159.68,71.93 159.68,68.75 160.31,68.12 160.31,63.04 158.72,61.45 152.37,61.45 v152.06,61.77 | v149.2,64.63 149.83,63.99
  Bottom 0.254: v152.06,61.77 v149.2,64.63
N$44  (via drill 0.3)
  Top 0.254: IC3.2 28.2,47.41 v27.93,47.15 | v26.64,45.44 R29.1 C24.2 R30.2
  Bottom 0.254: v27.93,47.15 26.64,45.85 v26.64,45.44
N$45
  Top 0.254: C29.+ R30.1
N$46
  Top 0.254: IC3.7 31.45,47.56 C18.2 | C18.2 R48.2 | R33.2 33.31,51.93 34.26,50.98 34.26,47.48 32.99,46.21 C18.2
N$47
  Top 0.254: IC3.5 30.15,46.77 30.45,46.46 30.45,43.16 R34.2
N$48
  Top 0.254: IC5.4 49.82,37.13 R38.1 49.5,35.54 49.5,33.64 R37.1
N$49
  Top 0.254: IC5.3 R35.2 47.83,35.77 47.83,33.41 R36.2
N$50  (1 unrouted)
  Top 0.254: IC5.5 51.09,37.32 51.41,37.01 51.41,33.64 R39.1
N$51
  Top 0.254: IC4.2 61.73,42.75 R40.1 C22.1
N$52
  Top 0.254: R41.1 C22.2 R40.2 62.6,43.4 IC4.1
N$53  (via drill 0.3)
  Top 0.254: R38.2 v50.46,34.15 | v49.19,29.38 49.19,28.34 U$71.2
  Bottom 0.254: v50.46,34.15 49.19,32.88 v49.19,29.38
N$54  (via drill 0.3)  (1 unrouted)
  Top 0.254: Q1.B 46.01,34.31 v46.01,34.41 | v53.31,35.73 54.25,34.8 D17.ANODE
  Bottom 0.254: v46.01,34.41 47.34,35.73 v53.31,35.73
N$55  (1 unrouted)
  Top 0.254: IC4.6 61.73,40.15 R44.2 59.6,39.67 R45.2 59.47,39.74 58.71,40.5 57.44,40.5 57.12,40.18 57.12,38.91 D17.CATHODE
N$56  (1 unrouted)
  Top 0.254: Q1.E 46.96,31.73 R42.2
N$57
  Top 0.254: Q1.C IC5.1
N$58
  Top 0.254: R45.1 58.08,39.42 U$70.2
N$59  (1 unrouted)
N$60
  Top 0.254: 25.69,55.75 R47.2 26.14,55.93 27.6,54.47 27.6,53.94 IC3.14 IC3.13
N$61
  Top 0.254: IC3.12 28.85,54.67 R46.2 28.36,56.69 30.77,56.69 D15.CATHODE 31.72,61.16 C17.+
N$62
  Top 0.254: IC3.6 30.8,46.69 C18.1 R48.1
N$63
  Top 0.254: R51.1 131.1,53.83 U$74.P$3
N$64  (1 unrouted)
  Top 0.254: R60.2 C32.2 | R61.1 134.4,40.05 133.32,41.13 133.32,41.77 133.93,42.37 IC8.9
N$65  (1 unrouted)
N$66
  Top 0.254: J22.TIP_B@1 144.44,78.28 139.04,72.88 139.04,61.77 139.99,60.82 143.8,60.82 144.44,60.18 144.44,50.5 R49.P$3
N$67  (1 unrouted)
  Top 0.254: R59.2 R57.1 129.01,66.98 128.24,66.22 T1.E D14.CATHODE
N$68  (1 unrouted)
  Top 0.254: R50.P$2 144.44,30.34 146.66,32.56 153.33,32.56
N$69  (1 unrouted)
  Top 0.254: U$74.P$2 U$74.P$1 130.2,47.88 R75.2 C38.2 | R74.2 133.01,50.66
N$70
  Top 0.254: IC8.7 129.56,41.72 129.83,41.45 129.83,40.62 R63.2 R62.1 R64.2 125.83,37.01 124.75,37.01 122.97,38.78 C33.1
N$71
  Top 0.254: C33.2 121.45,40.05 122.21,40.81 124.31,40.81 R62.2 125.26,40.24 C39.2 127.39,42.37 IC8.6
N$72  (1 unrouted)
  Top 0.254: C39.1 R52.1
N$73  (1 unrouted)
  Top 0.254: D5.ANODE 131.43,37.97 D6.CATHODE 130.59,37.51 R63.1
N$74
  Top 0.254: 151.29,46.28 R80.2 R79.2 | R65.1 151.29,46.28 | 151.29,46.28 151.29,46.85 | IC9.1 152.96,46.48 152.69,46.21 151.61,46.21 R65.1 | C34.1 R65.1
N$75
  Top 0.254: 153.01,42.4 153.01,43.16 R79.1 | IC9.5 155.56,46.2 156.18,45.58 156.18,42.72 155.55,42.09 | 153.33,42.09 153.17,42.24 | 153.17,42.24 153.01,42.4 | D8.CATHODE 152.06,41.13 153.01,42.09 | 153.01,42.09 153.17,42.24 | D7.ANODE 155.25,41.78 | 153.33,42.09 154.94,42.09 | 154.94,42.09 155.25,41.78 | 155.55,42.09 155.25,41.78 | 154.94,42.09 155.55,42.09 | 153.33,42.09 153.01,42.09 | 153.01,42.4 153.01,42.09 | 153.01,42.09
N$76  (1 unrouted)
  Top 0.254: C34.2 R65.2 151.55,48.12 153.33,48.12 153.61,47.83 IC9.2
N$77  (via drill 0.3)
  Top 0.254: 157.14,45.9 157.77,45.9 158.41,46.53 R66.2 C35.2 | 157.14,45.9 156.82,45.9 156.21,46.5 IC9.6 | R80.1 v153.64,44.62 | v156.82,44.62 157.14,44.94 157.14,45.9
  Bottom 0.254: v153.64,44.62 v156.82,44.62
N$78
  Top 0.254: C35.1 R66.1 157.58,48.88 156.86,48.16 IC9.7 | R81.2 160.95,47.48 160.31,48.12 160.31,48.24 C35.1 | R67.2 160.95,50.98 160.31,50.34 160.31,49.51 C35.1
N$79  (via drill 0.3)
  Top 0.254: IC9.10 155.56,51.28 156.82,50.02 v159.36,50.02 | R81.1 161.26,49.2 v161.26,50.02 161.9,50.66 D9.CATHODE 164.45,50.01 D12.ANODE
  Bottom 0.254: v159.36,50.02 v161.26,50.02
N$80
  Top 0.254: IC9.8 156.86,53.56 157.14,53.83 | 157.14,53.83 158.09,53.83 158.41,53.52 R84.1 C36.1 | R83.2 R82.2 157.14,54.66 157.14,53.83
N$81
  Top 0.254: IC9.9 156.21,51.58 156.63,51.17 R84.2 C36.2 159.68,51.42 R67.1
N$82
  Top 0.254: R82.1 155.67,57.64 154.28,57.64 153.96,57.33 153.96,54.47 154.26,54.16 IC9.12 154.26,51.28 152.69,49.7 148.26,49.7 D11.ANODE 147.94,50.33 D10.CATHODE
N$83
  Top 0.254: C40.2 R68.2 152.88,51.17 153.61,51.9 IC9.13 153.61,53.86 153.33,54.15 153.33,57.64 153.96,58.28 157.14,58.28 158.09,57.33 R83.1
N$84  (1 unrouted)
  Top 0.254: R77.1 R78.1 | IC9.14 152.96,53.56 152.69,53.83 152.25,53.83 R68.1 C40.1
N$85  (1 unrouted)
  Top 0.254: IC8.3 128.8,44.31 127.61,44.31 127.29,44.62 124.99,44.62 124.12,45.5 124.12,46.34 R77.2 122.97,48.9 D3.ANODE
N$86  (via drill 0.3)
  Top 0.254: R78.2 123.13,45.74 v123.13,46.18 | v124.43,47.48 C41.2 R76.1 125.26,45.77 v126.02,46.53 | v127.93,46.53 129.83,46.53 130.15,46.21 130.15,45.58 129.54,44.97 IC8.2
  Bottom 0.254: v123.13,46.18 v124.43,47.48 | v126.02,46.53 v127.93,46.53
N$87
  Top 0.254: IC8.1 126.83,45.62 R76.2 C41.1 R75.1 129.07,49.51 U$92.P$1
N$88
  Top 0.254: C38.1 133.32,46.4 133.32,44.94 133.96,44.31 134.64,44.31 IC8.12 134.73,44.4 136.59,44.4 136.82,44.62 137.07,44.62 137.41,44.28 137.41,43.71 137.49,43.63 137.49,43.18 137.95,42.72 139.55,42.72 R73.2
N$89
  Top 0.254: IC8.14 134.96,45.62 135.86,46.53 | C37.1 137.26,46.53 135.86,46.53 | R70.2 141.26,46.34 141.26,47.94 140.77,48.44 136.18,48.44 135.86,48.12 135.86,46.53
N$90
  Top 0.254: IC8.13 136.08,44.97 C37.2 137.64,44.62 138.72,44.62 139.36,45.26 139.36,46.34 | 139.36,46.34 R71.2 | R72.1 136.99,47.48 137.72,46.76 138.94,46.76 139.36,46.34
N$91
  Top 0.254: T1.B 124.45,65.43 R56.1 125.07,64.82 D13.CATHODE
N$92
  Top 0.254: R53.1 T1.C
N$93
  Top 0.254: IC10.1 R53.2
N$94
  Top 0.254: IC10.3 R54.2 R85.1
N$95
  Top 0.254: R86.2 132.37,65.98 U$93.2
N$96
  Top 0.254: IC10.4 R55.2 R86.1
N$97
  Top 0.254: IC10.13 R87.2 R89.1
N$98
  Top 0.254: IC10.14 R88.2 R90.1
N$106
  Top 0.254: IC5.13 49.82,45.77 | 49.82,45.77 R101.1 | R100.1 49.5,49.26 49.5,46.09 49.82,45.77
N$107
  Top 0.254: IC5.14 R98.2 47.6,47.35 47.6,48.44 48.55,49.39 R99.2
N$108  (1 unrouted)
  Top 0.254: IC5.12 51.09,45.26 51.41,45.58 51.41,49.26 R102.1
N$109
  Top 0.254: IC4.13 71.57,42.75 R103.1 C44.1
N$110
  Top 0.254: R104.1 C44.2 R103.2 70.69,43.4 IC4.14
N$111  (1 unrouted)
N$112  (via drill 0.3)  (1 unrouted)
  Top 0.254: Q3.B 47.02,49.48 v47.81,49.48 | v53.31,46.21 D18.ANODE
  Bottom 0.254: v47.81,49.48 51.08,46.21 v53.31,46.21
N$113  (2 unrouted)
  Top 0.254: IC4.9 71.89,40.15 R108.2 74.01,39.67 R107.2
N$114
  Top 0.254: R105.2 R106.2 44.74,49.85 Q3.E
N$115
  Top 0.254: IC5.16 Q3.C
N$116
  Top 0.254: U$112.2 72.09,37.87 R108.1
N$117  (1 unrouted)
N$118
  Top 0.254: R3.1 R4.2 51.73,64.44 51.73,63.36 52.01,63.07 IC2.2
OTA_CONTROL
  Top 0.254: IC10.16 127.29,80.36 Q4.C
OTA_OUT  (2 unrouted)
  Top 0.254: IC10.12 132.37,79.42 R91.2
OUTPUT_A  (3 unrouted)
OUTPUT_B  (3 unrouted)
OUTPUT_C  (2 unrouted)
  Top 0.254: J14.SWITCH_T@3 120.2,93.09 110.46,83.36 R95.1
OUTPUT_D  (via drill 0.3)  (2 unrouted)
  Top 0.254: J17.SWITCH_T@3 152.06,98.6 141.58,88.12 138.09,88.12 | 138.09,88.12 v116.5,88.12 | v113.96,88.12 113,87.17 R96.1 | U$22.P$13 140.63,2.08 138.72,3.99 138.72,17.32 137.45,18.59 133.64,18.59 131.74,20.5 131.74,32.24 | 139.99,53.83 139.99,59.87 138.4,61.45 138.4,87.81 138.09,88.12
  Bottom 0.254: v116.5,88.12 v113.96,88.12
OUTPUT_E  (2 unrouted)
  Top 0.254: J19.TIP_T@3 172.38,98.6 167.61,93.84 167.61,72.25 163.49,68.12 163.49,64.94 159.04,60.5 153.33,60.5 152.06,59.23 150.15,59.23 149.52,59.87 149.52,60.69 R23.2
OUTPUT_WS  (1 unrouted)
  Top 0.254: R71.1 R70.1
VCA_CV_IN1
  Top 0.254: R69.P$3 22.56,37.92 16.17,44.31 7.65,44.31 J21.TIP_B@1
VCA_CV_IN2
  Top 0.254: R109.P$3 164.8,58.32 169.2,62.72 169.2,77.06 J1.TIP_B@1
VCA_OUTPUT1  (3 unrouted)
VCA_OUTPUT2  (4 unrouted)
VCA_SIG_IN
  Top 0.254: R32.1 R33.1 32.55,52.88 30.45,52.88 30.15,53.18 IC3.10

## Text on the board
tValues: <9v 12v>